# EAGLE schematic CrystalVideo_schematic (EAGLE 7.7.0)
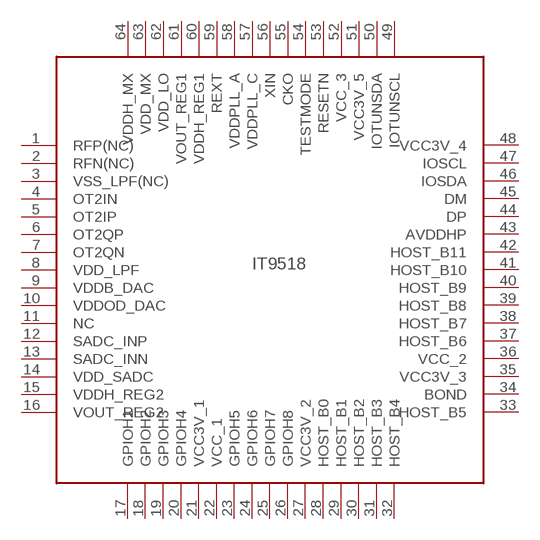
[diagram p0: schematic, sheet 1]

## Parts
U$1  IT9518  [QFN64P40_IT9518]
Unconnected: U$1.1(RFP(NC)) U$1.2(RFN(NC)) U$1.3(VSS_LPF(NC)) U$1.4(OT2IN) U$1.5(OT2IP) U$1.6(OT2QP) U$1.7(OT2QN) U$1.8(VDD_LPF) U$1.9(VDDB_DAC) U$1.10(VDDOD_DAC) U$1.11(NC) U$1.12(SADC_INP) U$1.13(SADC_INN) U$1.14(VDD_SADC) U$1.15(VDDH_REG2) U$1.16(VOUT_REG2) U$1.17(GPIOH1) U$1.18(GPIOH2) U$1.19(GPIOH3) U$1.20(GPIOH4) U$1.21(VCC3V_1) U$1.22(VCC_1) U$1.23(GPIOH5) U$1.24(GPIOH6) U$1.25(GPIOH7) U$1.26(GPIOH8) U$1.27(VCC3V_2) U$1.28(HOST_B0) U$1.29(HOST_B1) U$1.30(HOST_B2) U$1.31(HOST_B3) U$1.32(HOST_B4) U$1.33(HOST_B5) U$1.34(BOND) U$1.35(VCC3V_3) U$1.36(VCC_2) U$1.37(HOST_B6) U$1.38(HOST_B7) U$1.39(HOST_B8) U$1.40(HOST_B9) U$1.41(HOST_B10) U$1.42(HOST_B11) U$1.43(AVDDHP) U$1.44(DP) U$1.45(DM) U$1.46(IOSDA) U$1.47(IOSCL) U$1.48(VCC3V_4) U$1.49(IOTUNSCL) U$1.50(IOTUNSDA) U$1.51(VCC3V_5) U$1.52(VCC_3) U$1.53(RESETN) U$1.54(TESTMODE) U$1.55(CKO) U$1.56(XIN) U$1.57(VDDPLL_C) U$1.58(VDDPLL_A) U$1.59(REXT) U$1.60(VDDH_REG1) U$1.61(VOUT_REG1) U$1.62(VDD_LO) U$1.63(VDD_MX) U$1.64(VDDH_MX)

## Library data of the parts
U$1 = CrystalVideo:IT9518: ITE IT9518 MFQN 64 pin package COFDM SOC modulator